# Altium project COM_DIO_MCX.PrjPCB (part 2 of 2)

## Sheet MCX_Buffer.SchDoc: DIO MCX 16
size 420 x 297 mm; Author: G.Kasprowicz; CompanyName: WUT ISE; DrawnBy: G.Kasprowicz; Organization: WUT ISE; Address1: PW ISE; Address2: Nowowiejska 15/19 00-665 Warsaw; Address3: gkasprow@gmail.com; DocumentNumber: 5; Revision: 2; SheetNumber: 5; SheetTotal: 7; ModifiedBy: -; CheckedDate: -; Title2: TTL buffers; DivGrp: WUT ISE; Designer: G.Kasprowicz; ModifiedDate: -; ProjectName: Sensor Box
Used 2 times, as channels U_DIO_MCX/U_MCX_BufferA, U_DIO_MCX/U_MCX_BufferB. Parts and nets are listed once, with the designators drawn on the sheet.
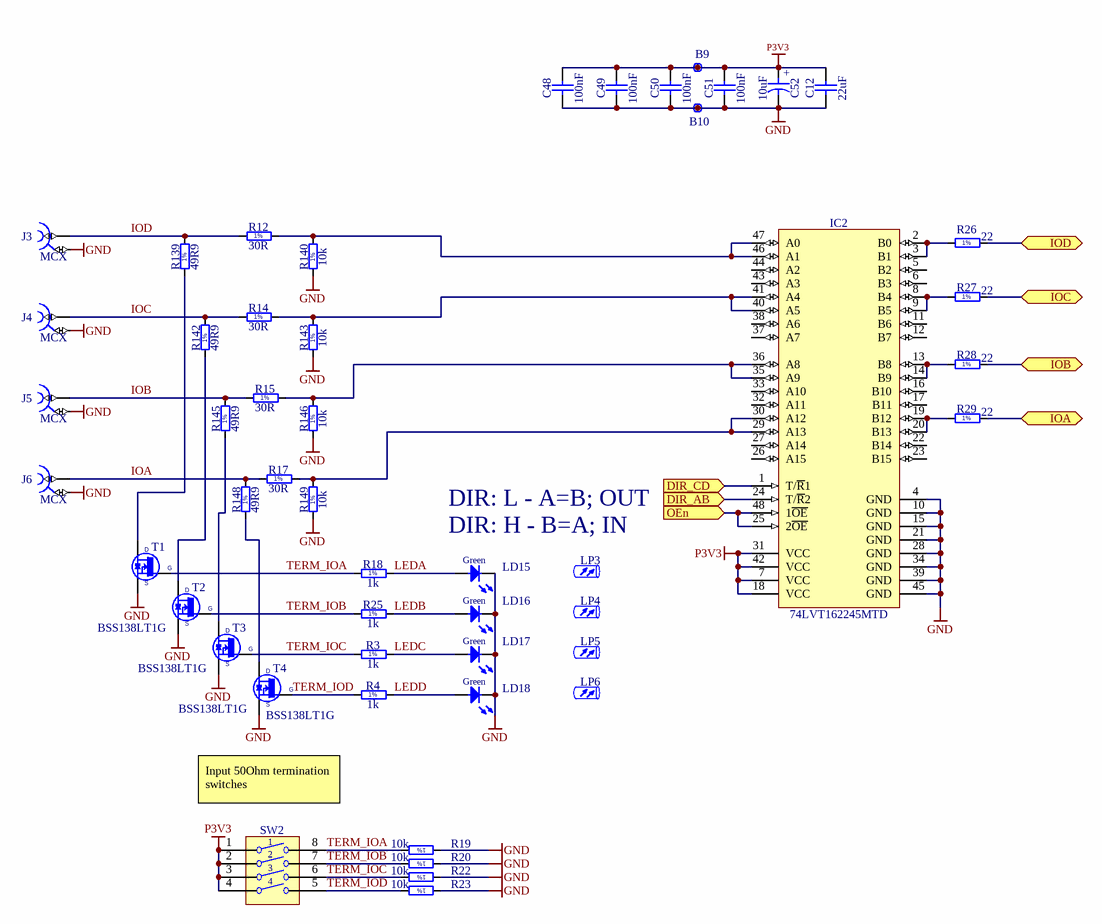
[diagram p4: MCX_Buffer.SchDoc]

### Parts
B9  Plated Hole  [c130h60]  (value not drawn)
B10  Plated Hole  [c130h60]  (value not drawn)
C12  22uF  [CAPC2012X135N]
C48  100nF  [CAPC1005X55N]
C49  100nF  [CAPC1005X55N]
C50  100nF  [CAPC1005X55N]
C51  100nF  [CAPC1005X55N]
C52  10uF  [CAPAE430X540N]
IC2  74LVT162245MTD  [SOP50P810X120-48N]
J3  MCX  [Belfuse_133-3701-801]
J4  MCX  [Belfuse_133-3701-801]
J5  MCX  [Belfuse_133-3701-801]
J6  MCX  [Belfuse_133-3701-801]
LD15  Green  [LED_AVAGO_HSME-C120]  (value not drawn)
LD16  Green  [LED_AVAGO_HSME-C120]  (value not drawn)
LD17  Green  [LED_AVAGO_HSME-C120]  (value not drawn)
LD18  Green  [LED_AVAGO_HSME-C120]  (value not drawn)
LP3  (no value)  [FIX&FASTEN-LEMB2-8V0-F]
LP4  (no value)  [FIX&FASTEN-LEMB2-8V0-F]
LP5  (no value)  [FIX&FASTEN-LEMB2-8V0-F]
LP6  (no value)  [FIX&FASTEN-LEMB2-8V0-F]
R3  1k  [RESC1005X40N]
R4  1k  [RESC1005X40N]
R12  30R  [RESC3225X70N]
R14  30R  [RESC3225X70N]
R15  30R  [RESC3225X70N]
R17  30R  [RESC3225X70N]
R18  1k  [RESC1005X40N]
R19  10k  [RESC1005X40N]
R20  10k  [RESC1005X40N]
R22  10k  [RESC1005X40N]
R23  10k  [RESC1005X40N]
R25  1k  [RESC1005X40N]
R26  22  [RESC1005X40N]
R27  22  [RESC1005X40N]
R28  22  [RESC1005X40N]
R29  22  [RESC1005X40N]
R139  49R9  [RESC3225X70N]
R140  10k  [RESC1005X40N]
R142  49R9  [RESC3225X70N]
R143  10k  [RESC1005X40N]
R145  49R9  [RESC3225X70N]
R146  10k  [RESC1005X40N]
R148  49R9  [RESC3225X70N]
R149  10k  [RESC1005X40N]
SW2  Switch  [SW_OMRON_A6S-4102-H]  (value not drawn)
T1  BSS138LT1G  [SOT95P240X110-3N]
T2  BSS138LT1G  [SOT95P240X110-3N]
T3  BSS138LT1G  [SOT95P240X110-3N]
T4  BSS138LT1G  [SOT95P240X110-3N]

### Ports
DIR_AB (in), DIR_CD (in), IOA (bidir), IOB (bidir), IOC (bidir), IOD (bidir), OEn (in)

### Nets
GND: B10.1 C12.1 C48.1 C49.1 C50.1 C51.1 C52.2 IC2.4(GND) IC2.10(GND) IC2.15(GND) IC2.21(GND) IC2.28(GND) IC2.34(GND) IC2.39(GND) IC2.45(GND) J3.2 J4.2 J5.2 J6.2 LD15.1(C) LD16.1(C) LD17.1(C) LD18.1(C) R19.1 R20.1 R22.1 R23.1 R140.1 R143.1 R146.1 R149.1 T1.2(S) T2.2(S) T3.2(S) T4.2(S)
P3V3: B9.1 C12.2 C48.2 C49.2 C50.2 C51.2 C52.1 IC2.7(VCC) IC2.18(VCC) IC2.31(VCC) IC2.42(VCC) SW2.1 SW2.2 SW2.3 SW2.4
DIR_AB: IC2.24(T/~{R}2) ; port DIR_AB
DIR_CD: IC2.1(T/~{R}1) ; port DIR_CD
IOA: J6.1 R17.1 R148.2
IOA: R29.2 ; port IOA  [a separate net that carries the same name]
IOB: J5.1 R15.1 R145.2
IOB: R28.2 ; port IOB  [a separate net that carries the same name]
IOC: J4.1 R14.1 R142.2
IOC: R27.2 ; port IOC  [a separate net that carries the same name]
IOD: J3.1 R12.1 R139.2
IOD: R26.2 ; port IOD  [a separate net that carries the same name]
LEDA: LD15.2(A) R18.2
LEDB: LD16.2(A) R25.2
LEDC: LD17.2(A) R3.2
LEDD: LD18.2(A) R4.2
OEn: IC2.25(2~{OE}) IC2.48(1~{OE}) ; port OEn
TERM_IOA: R18.1 R19.2 SW2.8 T1.1(G)
TERM_IOB: R20.2 R25.1 SW2.7 T2.1(G)
TERM_IOC: R3.1 R22.2 SW2.6 T3.1(G)
TERM_IOD: R4.1 R23.2 SW2.5 T4.1(G)
NetIC2_2: IC2.2(B0) IC2.3(B1) R26.1
NetIC2_8: IC2.8(B4) IC2.9(B5) R27.1
NetIC2_13: IC2.13(B8) IC2.14(B9) R28.1
NetIC2_19: IC2.19(B12) IC2.20(B13) R29.1
NetIC2_29: IC2.29(A13) IC2.30(A12) R17.2 R149.2
NetIC2_35: IC2.35(A9) IC2.36(A8) R15.2 R146.2
NetIC2_40: IC2.40(A5) IC2.41(A4) R14.2 R143.2
NetIC2_46: IC2.46(A1) IC2.47(A0) R12.2 R140.2
NetR139_1: R139.1 T1.3(D)
NetR142_1: R142.1 T2.3(D)
NetR145_1: R145.1 T3.3(D)
NetR148_1: R148.1 T4.3(D)

Not connected (* = marked no-connect by the designer): IC2 5(B2) 6(B3) 11(B6) 12(B7) 16(B10) 17(B11) 22(B14) 23(B15) 26(A15) 27(A14) 32(A11) 33(A10) 37(A7) 38(A6) 43(A3) 44(A2)

### Channels
U_DIO_MCX/U_MCX_BufferA: designators end in A; ports DIR_AB=NetIC2A_24 DIR_CD=NetIC2A_1 IOA=NetR29A_2 IOB=NetR28A_2 IOC=NetR27A_2 IOD=NetR26A_2 OEn=NetIC2A_25
U_DIO_MCX/U_MCX_BufferB: designators end in B; ports DIR_AB=NetIC2A_24 DIR_CD=NetIC2A_1 IOA=NetR29A_2 IOB=NetR28A_2 IOC=NetR27A_2 IOD=NetR26A_2 OEn=NetIC2A_25

### Notes on the sheet
- DIR: L - A=B; OUT
- DIR: H - B=A; IN
- Input 50Ohm termination switches
- Project/Equipment
- Document
- Designer
- Drawn by
- Check.by
- Copyright WUT ISE 2018.
  This documentation describes Open Hardware and is licensed under the CERN OHL v.1.1. You may redistribute and modify this documentation under the terms of the CERN OHL v.1.1. (http://ohwr.org/CERNOHL). This documentation is distributed WITHOUT ANY EXPRESS OR IMPLIED WARRANTY, INCLUDING OF MERCHANTABILITY, SATISFACTORY QUALITY AND FITNESS FOR A PARTICULAR PURPOSE. Please see the CERN OHL v.1.1 for applicable conditions.
- Contact
- File
- Last Mod.
- Print Date
- Sheet
- Size
- A3
- of
- Rev
- (in symbol CAE430-540_10UF_16V_20%) +
- (in symbol R0402_1K_1%_0.0625W_100PPM) 1%
- (in symbol R0402_10K_1%_0.0625W_100PPM) 1%
- (in symbol R0402_22R_1%_0.0625W_100PPM) 1%
- (in symbol R1210_30R_5%_0.5W_200PPM) 1%
- (in symbol R1210_49R9_1%_0.5W_100PPM_VISHAY_CRCW) 1%

### Library data of the parts
B9 B10 = PLATED_HOLE0.6_PAD1.3: Single Terminal Socket; Part Description: Plated Through Hole: Hole Dia.=0.6mm Pad Dia.=1.3mm; Mounted: No; Part Number: PLATED_HOLE0.6_PAD1.3; Component Kind: Standard (No BOM); Component Type: Standard (No BOM); Pin Count: 1; Family: Plated Hole; Socket: No; SMD: No; Sense: No; Status: None; ComponentHeight: 0mm; HelpURL: Undefined; Author: CERN DEM MR; CreateDate: 02.03.2016; LatestRevisionDate: 02.03.2016; PackageDescription: Plated Through Hole: Hole Dia.=0.6mm Pad Dia.=1.3mm
C12 = CC0805_22UF_16V_10%_X5R: Non-polarised capacitor; Part Description: SMD Multilayer Chip Ceramic Capacitor; Manufacturer: GENERIC; Manufacturer1 Part Number: C2012X5R1C226KT; Voltage: 16V; TC: X5R; Tolerance: ±10%; Part Number: CC0805_22UF_16V_10%_X5R; Component Kind: Standard; Component Type: Standard; Pin Count: 2; Value: 22uF; Status: Preferred; Manufacturer Part Number: CC0805_22UF_16V_10%_X5R; Case: 0805; Mounted: Yes; Socket: No; SMD: Yes; Sense: No; Manufacturer1 Example: TDK; Manufacturer1 ComponentHeight: 1.35mm; HelpURL: \\cern.ch\dfs\Applications\Altium\Datasheets\CC0805_X5R_TDK_C.pdf; Author: CERN DEM JLC; CreateDate: 25.10.2012; LatestRevisionDate: 25.10.2012
C48-C51 = CC0402_100NF_16V_10%_X5R: Non-polarised capacitor; Part Description: SMD Multilayer Chip Ceramic Capacitor; Manufacturer: GENERIC; Manufacturer1 Part Number: GRM155R61C104KA88D; Voltage: 16V; TC: X5R; Tolerance: ±10%; Part Number: CC0402_100NF_16V_10%_X5R; Component Kind: Standard; Component Type: Standard; Pin Count: 2; Value: 100nF; Status: None; Manufacturer Part Number: CC0402_100NF_16V_10%_X5R; Case: 0402; Mounted: Yes; Socket: No; SMD: Yes; Sense: No; Manufacturer1 Example: MURATA; Manufacturer1 ComponentHeight: 0.55mm; HelpURL: \\cern.ch\dfs\Applications\Altium\Datasheets\CC0402_X5R_MURATA_GRM.pdf; Author: CERN DEM JLC; CreateDate: 10.12.2013; LatestRevisionDate: 10.12.2013
C52 = CAE430-540_10UF_16V_20%: Polarised capacitor; Part Description: Aluminum Electrolytic SMT Capacitor; Manufacturer: PANASONIC; Manufacturer Part Number: EEEFK1C100AR; Voltage: 16V; Tolerance: ±20%; Part Number: CAE430-540_10UF_16V_20%; Component Kind: Standard; Component Type: Standard; Pin Count: 2; Value: 10uF; Status: Not Recommended; Case: B; Mounted: Yes; Socket: No; SMD: Yes; Sense: No; ComponentHeight: 5.8mm; HelpURL: \\cern.ch\dfs\Applications\Altium\Datasheets\CAE_PANASONIC_FK.pdf; Author: CERN DEM JLC; CreateDate: 03.12.2007; LatestRevisionDate: 05.11.2014
IC2 = 74LVT162245MTD: Low Voltage 16-Bit Transceiver with 3-STATE Outputs and 25 Ohm Series Resistors in A Port Outputs; Manufacturer: FAIRCHILD SEMICONDUCTOR; PressFit: No; Bonding: No; Part Number: 74LVT162245MTD; Component Kind: Standard; Component Type: Standard; Device: 74LVT162245MTD; PackageDescription: SOP, 48-Leads, Body 12.6x6.2mm (max), Pitch 0.50mm, IPC Medium Density; Part Description: Low Voltage 16-Bit Transceiver with 3-STATE Outputs and 25 Ohm Series Resistors in A Port Outputs; Manufacturer Part Number: 74LVT162245MTD; Pin Count: 48; Case: TSSOP48; Mounted: Yes; Socket: No; SMD: Yes; Sense: No; ComponentHeight: 1.2mm; Author: CERN DEM MR; HelpURL: \\cern.ch\dfs\Applications\Altium\Datasheets\74LVT162245MTD.pdf; CreateDate: 06.12.2016; LatestRevisionDate: 06.12.2016
J3-J6 = CON_MCX_133-3701-801: MCX 50 OhmEnd Launch Jack Receptacle -Round C ontact; Part Number: Belfuse_133-3701-806; Part Description: 50 Ohm, RF Connector, MCX Right Angle PCB Receptacle Jack; Manufacturer: Belfuse/Cinch; Manufacturer Part Number: 133-3701-806; PressFit: No; Component Kind: Standard; Component Type: Standard; Footprint: Belfuse_133-3701-806; Pin Count: 5; Family: MCX; Mounted: Yes; Socket: No; SMD: Yes; Sense: No; Status: None; ComponentHeight: 6mm; HelpURL: \\cern.ch\dfs\Applications\Altium\Datasheets\AMPHENOL_919-383J-51A.pdf; Author: GK; CreateDate: 31.01.2019; LatestRevisionDate: 31.01.2019
LD15-LD18 = LED_AVAGO_HSME-C120: LED Green 1C 2A; Part Description: High Performance Right Angle Chip Green LED; Manufacturer: AVAGO TECHNOLOGIES; PressFit: No; Bonding: No; Part Number: LED_AVAGO_HSME-C120; Component Kind: Standard; Component Type: Standard; Color: Green; PackageDescription: Green Chip LED, 2-Leads, Body 1.7x1.1mm, Side Emitting Package; Manufacturer Part Number: HSME-C120; Pin Count: 2; Mounted: Yes; Socket: No; SMD: Yes; Sense: No; ComponentHeight: 0.7mm; HelpURL: \\cern.ch\dfs\Applications\Altium\Datasheets\LED_AVAGO_HSME-C120.pdf; ComponentLink1URL: \\cern.ch\dfs\Applications\Altium\Datasheets\LED_AVAGO_HSME-C110_DESIGN-GUIDE.pdf; ComponentLink1Description: Design Guide; Author: CERN DEM JMW; CreateDate: 22.07.2009; LatestRevisionDate: 20.06.2012
LP3-LP6 = LED Light_pipe_2.3x8mm: Part Description: Right Angle Single Element 2.3x8mm Round Lightpipe; Manufacturer: FIX&FASTEN; Manufacturer Part Number: FIX-LEMB2-8V0-F; PressFit: No; Bonding: No; Part Number: FIX&FASTEN-LEMB2-8V0-F; Component Kind: Accessories; Component Type: Standard; PackageDescription: Right Angle Single Element 2.3mmx8mm Round Lightpipe; Pin Count: 0; Mounted: Yes; Socket: No; SMD: No; Sense: No; ComponentHeight: 2.3mm; HelpURL: \\cern.ch\dfs\Applications\Altium\Datasheets\LEDLP_DIALIGHT_515-1049F.pdf; Author: GK; CreateDate: 24.01.2017; LatestRevisionDate: 24.01.2017
R3 R4 R18 R25 = R0402_1K_1%_0.0625W_100PPM: Resistor - 1%; Part Description: General Purpose Thick Film Chip Resistor; Manufacturer: GENERIC; Manufacturer1 Part Number: 232270671002L; TC: ±100ppm/°C; PressFit: No; Part Number: R0402_1K_1%_0.0625W_100PPM; Component Kind: Standard; Component Type: Standard; Pin Count: 2; Value: 1k; Status: Not Recommended; Power: 0.0625W; Tolerance: ±1%; Manufacturer Part Number: R0402_1K_1%_0.0625W_100PPM; Case: 0402; Mounted: Yes; Sense: No; Socket: No; SMD: Yes; Manufacturer1 Example: YAGEO PHYCOMP; Manufacturer1 ComponentHeight: 0.4mm; HelpURL: \\cern.ch\dfs\Applications\Altium\Datasheets\R0402_Phycomp_RC0402.pdf; Author: CERN DEM JLC; CreateDate: 03.12.2007; LatestRevisionDate: 17.10.2012
R12 R14 R15 R17 = R1210_30R_5%_0.5W_200PPM: Resistor - 5%; Part Description: Thick Film Chip Resistor; Manufacturer: VISHAY; Manufacturer Part Number: CRCW121030R0JNEA; Power: 0.5W; TC: ±200ppm/°C; PressFit: No; Part Number: R1210_30R_5%_0.5W_200ppm; Component Kind: Standard; Component Type: Standard; Pin Count: 2; Value: 30R; Status: None; Tolerance: ±5%; Case: 1210; Mounted: Yes; Sense: No; Socket: No; SMD: Yes; HelpURL: \\cern.ch\dfs\Applications\Altium\Datasheets\R1210_VISHAY_CRCW1210.pdf; Author: CERN DEM JMW; CreateDate: 06.08.2014; LatestRevisionDate: 06.08.2014; ComponentHeight: 0.6mm
R19 R20 R22 R23 R140 R143 R146 R149 = R0402_10K_1%_0.0625W_100PPM: Resistor - 1%; Part Description: General Purpose Thick Film Chip Resistor; Manufacturer: GENERIC; Manufacturer1 Part Number: 232270671003L; TC: ±100ppm/°C; Part Number: R0402_10K_1%_0.0625W_100PPM; Component Kind: Standard; Component Type: Standard; Pin Count: 2; Value: 10k; Status: Not recommended; Power: 0.0625W; Tolerance: ±1%; Manufacturer Part Number: R0402_10K_1%_0.0625W_100PPM; Case: 0402; Mounted: Yes; Sense: No; Socket: No; SMD: Yes; Manufacturer1 Example: YAGEO PHYCOMP; Manufacturer1 ComponentHeight: 0.4mm; HelpURL: \\cern.ch\dfs\Applications\Altium\Datasheets\R0402_Phycomp_RC0402.pdf; Author: CERN DEM JLC; CreateDate: 03.12.2007; LatestRevisionDate: 17.10.2012
R26-R29 = R0402_22R_1%_0.0625W_100PPM: Resistor - 1%; Part Description: General Purpose Thick Film Chip Resistor; Manufacturer: GENERIC; Manufacturer1 Part Number: 232270672209L; TC: ±100ppm/°C; PressFit: No; Part Number: R0402_22R_1%_0.0625W_100PPM; Component Kind: Standard; Component Type: Standard; Pin Count: 2; Value: 22; Status: Not Recommended; Power: 0.0625W; Tolerance: ±1%; Manufacturer Part Number: R0402_22R_1%_0.0625W_100PPM; Case: 0402; Mounted: Yes; Sense: No; Socket: No; SMD: Yes; Manufacturer1 Example: YAGEO PHYCOMP; Manufacturer1 ComponentHeight: 0.4mm; HelpURL: \\cern.ch\dfs\Applications\Altium\Datasheets\R0402_Phycomp_RC0402.pdf; Author: CERN DEM JLC; CreateDate: 03.12.2007; LatestRevisionDate: 17.10.2012
R139 R142 R145 R148 = R1210_49R9_1%_0.5W_100PPM_VISHAY_CRCW: Resistor - 1%; Part Description: Thick Film Chip Resistor; Manufacturer: VISHAY DRALORIC; Manufacturer Part Number: CRCW121049R9FKTA; Power: 0.5W; TC: ±100ppm/°C; Part Number: R1210_49R9_1%_0.5W_100PPM_VISHAY_CRCW; Component Kind: Standard; Component Type: Standard; Pin Count: 2; Value: 49R9; Status: None; Tolerance: ±1%; Case: 1210; Mounted: Yes; Sense: No; Socket: No; SMD: Yes; ComponentHeight: 0.6mm; HelpURL: \\cern.ch\dfs\Applications\Altium\Datasheets\R1210_VISHAY_CRCW1210.pdf; Author: CERN DEM JMW; CreateDate: 06.08.2014; LatestRevisionDate: 06.08.2014
SW2 = SW_OMRON_A6S-4102-H: 4 Ways SPST DIP Switch; Part Description: 4 Ways SPST DIP Switch, White Flat Actuator with Seal Tape, Contact Rating 25mA 24VDC; Manufacturer: OMRON; PressFit: No; Part Number: SW_OMRON_A6S-4102-H; Component Kind: Standard; Component Type: Standard; Pin Count: 8; PackageDescription: Pitch 2.54mm, Body 11.3x6.4mm, 4 Ways SPST Surface-Mounting DIP Switch, OMRON A6S-H; Family: Switch; Mounted: Yes; Socket: No; SMD: Yes; Sense: No; Status: None; Manufacturer Part Number: A6S-4102-H; ComponentHeight: 3.8mm; HelpURL: \\cern.ch\dfs\Applications\Altium\Datasheets\SW_OMRON_A6S-4102-H.pdf; Author: CERN DEM JMW; CreateDate: 25.09.2008; LatestRevisionDate: 25.09.2008
T1-T4 = BSS138LT1G: N-CHANNEL MOSFET WITH DIODE; Part Description: 50V 200mA N-Channel Enhancement Mode Field-Effect Transistor; Manufacturer: ON SEMICONDUCTOR; PressFit: No; Bonding: No; Part Number: BSS138LT1G; Component Kind: Standard; Component Type: Standard; Device: BSS138LT1G; PackageDescription: SOT23 3-Leads, Pitch 0.95mm - Body 1.4x3mm, IPC Medium Density; Manufacturer Part Number: BSS138LT1G; Pin Count: 3; Case: SOT23-3; Mounted: Yes; Socket: No; SMD: Yes; Sense: No; ComponentHeight: 1.11mm; HelpURL: \\cern.ch\dfs\Applications\Altium\Datasheets\BSS138LT1G.pdf; Author: CERN DEM JLC; CreateDate: 23.03.2009; LatestRevisionDate: 23.03.2009

## Sheet MCX_Mezzanine.SchDoc: DIO MCX 16
size 420 x 297 mm; Author: G.Kasprowicz; CompanyName: WUT ISE; DrawnBy: G.Kasprowicz; Organization: WUT ISE; Address1: PW ISE; Address2: Nowowiejska 15/19 00-665 Warsaw; Address3: gkasprow@gmail.com; DocumentNumber: 6; Revision: 2; SheetNumber: 6; SheetTotal: 7; ModifiedBy: -; CheckedDate: -; Title2: Mezzanine; DivGrp: WUT ISE; Designer: G.Kasprowicz; ModifiedDate: -; ProjectName: Sensor Box
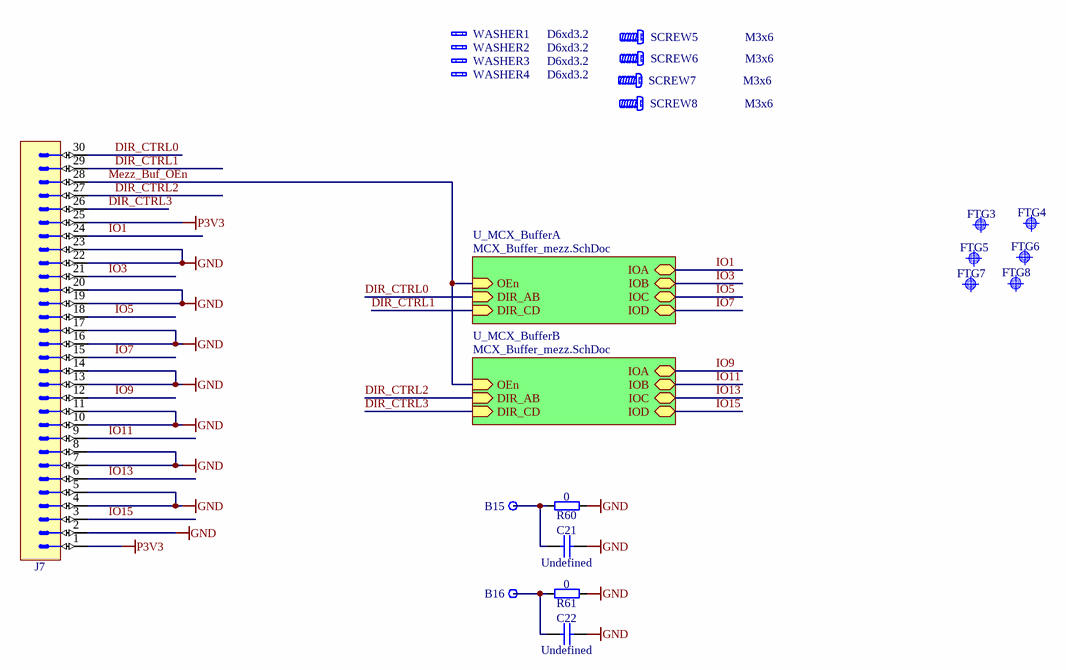
[diagram p5: MCX_Mezzanine.SchDoc]

### Parts
B15  Plated Hole  [MTG270_500]  (value not drawn)
B16  Plated Hole  [MTG270_500]  (value not drawn)
C21  Undefined  [CAPC2012X135N]
C22  Undefined  [CAPC2012X135N]
FTG3  Use only in PCB  [FIDUCIAL_TOP_S100-200]  (value not drawn)
FTG4  Use only in PCB  [FIDUCIAL_TOP_C100-200]  (value not drawn)
FTG5  Use only in PCB  [FIDUCIAL_TOP_S100-200]  (value not drawn)
FTG6  Use only in PCB  [FIDUCIAL_TOP_C100-200]  (value not drawn)
FTG7  Use only in PCB  [FIDUCIAL_TOP_C100-200]  (value not drawn)
FTG8  Use only in PCB  [FIDUCIAL_TOP_S100-200]  (value not drawn)
J7  AMPMODU  [TYCO_1-215307-5]  (value not drawn)
R60  0  [RESC1608X55N]
R61  0  [RESC1608X55N]
SCREW5  M3x6  [BOSSARD_BN5687-3061605_v]
SCREW6  M3x6  [BOSSARD_BN5687-3061605_v]
SCREW7  M3x6  [BOSSARD_BN5687-3061605_v]
SCREW8  M3x6  [BOSSARD_BN5687-3061605_v]
WASHER1  D6xd3.2  [BOSSARD_B3/6/0.3/BN1976_v]
WASHER2  D6xd3.2  [BOSSARD_B3/6/0.3/BN1976_v]
WASHER3  D6xd3.2  [BOSSARD_B3/6/0.3/BN1976_v]
WASHER4  D6xd3.2  [BOSSARD_B3/6/0.3/BN1976_v]

### Sub-sheets
U_MCX_BufferA = MCX_Buffer_mezz.SchDoc: IOA (bidir), IOB (bidir), IOC (bidir), IOD (bidir), DIR_AB (in), OEn (in), DIR_CD (in)
U_MCX_BufferB = MCX_Buffer_mezz.SchDoc: OEn (in), DIR_AB (in), DIR_CD (in), IOA (bidir), IOB (bidir), IOC (bidir), IOD (bidir)

### Nets
GND: C21.2 C22.2 J7.2 J7.4 J7.5 J7.7 J7.8 J7.10 J7.11 J7.13 J7.14 J7.16 J7.17 J7.19 J7.20 J7.22 J7.23 R60.1 R61.1
P3V3: J7.1 J7.25
DIR_CTRL0: J7.30 ; sheet U_MCX_BufferA/DIR_AB
DIR_CTRL1: J7.29 ; sheet U_MCX_BufferA/DIR_CD
DIR_CTRL2: J7.27 ; sheet U_MCX_BufferB/DIR_AB
DIR_CTRL3: J7.26 ; sheet U_MCX_BufferB/DIR_CD
IO1: J7.24 ; sheet U_MCX_BufferA/IOA
IO3: J7.21 ; sheet U_MCX_BufferA/IOB
IO5: J7.18 ; sheet U_MCX_BufferA/IOC
IO7: J7.15 ; sheet U_MCX_BufferA/IOD
IO9: J7.12 ; sheet U_MCX_BufferB/IOA
IO11: J7.9 ; sheet U_MCX_BufferB/IOB
IO13: J7.6 ; sheet U_MCX_BufferB/IOC
IO15: J7.3 ; sheet U_MCX_BufferB/IOD
Mezz_Buf_OEn: J7.28 ; sheet U_MCX_BufferA/OEn, sheet U_MCX_BufferB/OEn
NetB15_1: B15.1 C21.1 R60.2
NetB16_1: B16.1 C22.1 R61.2

### Notes on the sheet
- Project/Equipment
- Document
- Designer
- Drawn by
- Check.by
- Copyright WUT ISE 2018.
  This documentation describes Open Hardware and is licensed under the CERN OHL v.1.1. You may redistribute and modify this documentation under the terms of the CERN OHL v.1.1. (http://ohwr.org/CERNOHL). This documentation is distributed WITHOUT ANY EXPRESS OR IMPLIED WARRANTY, INCLUDING OF MERCHANTABILITY, SATISFACTORY QUALITY AND FITNESS FOR A PARTICULAR PURPOSE. Please see the CERN OHL v.1.1 for applicable conditions.
- Contact
- File
- Last Mod.
- Print Date
- Sheet
- Size
- A3
- of
- Rev

### Library data of the parts
B15 B16 = PLATED_HOLE2.7_PAD5.0: Single Terminal Socket; Part Description: Plated Through Hole: Hole Dia.=2.7mm Pad Dia.=5.0mm; Mounted: No; Part Number: PLATED_HOLE2.7_PAD5.0; Component Kind: Standard (No BOM); Component Type: Standard (No BOM); Pin Count: 1; Family: Plated Hole; Socket: No; SMD: No; Sense: No; Status: None; ComponentHeight: 0mm; HelpURL: Undefined; Author: CERN DEM JMW; CreateDate: 27.09.2011; LatestRevisionDate: 27.09.2011; PackageDescription: Plated Through Hole: Hole Dia.=2.7mm Pad Dia.=5.0mm
C21 C22 = CC0805_NO-VALUE: Non-polarised capacitor; Part Description: Reserved Footprint For 0805(2012) Chip Ceramic Capacitor; Mounted: No; Part Number: CC0805_NO-VALUE; Component Kind: Standard; Component Type: Standard; Pin Count: 2; Value: Undefined; Status: None; Manufacturer: Undefined; Manufacturer Part Number: CC0805_NO-VALUE; Case: 0805; Socket: No; SMD: Yes; Sense: No; Manufacturer1 ComponentHeight: 1.35mm; HelpURL: Undefined; Author: CERN DEM JLC; CreateDate: 10.12.2008; LatestRevisionDate: 11.09.2013
FTG3 FTG5 FTG8 = FIDUCIAL_TARGET_S100-200: Fiducial Target; Part Description: Square Fiducial Target, Top Layer, 1.0mm, Top Solder 2.0mm, Keepout =2.0mm; Mounted: No; Part Number: FIDUCIAL_TARGET_S100-200; Component Kind: Standard (No BOM); Component Type: Standard (No BOM); Pin Count: 1; Family: Fiducial; Socket: No; SMD: Yes; Sense: No; Status: None; ComponentHeight: 0mm; HelpURL: Undefined; Author: CERN DEM JLC; CreateDate: 09.02.2010; LatestRevisionDate: 04.04.2012; PackageDescription: Square Fiducial Target, Top Layer, 1.0mm, Top Solder 2.0mm, Keepout =2.0mm
FTG4 FTG6 FTG7 = FIDUCIAL_TARGET_C100-200: Fiducial Target; Part Description: Round Fiducial Target, Top Layer, 1.0mm, Top Solder 2.0mm, Keepout =2.0mm; Mounted: No; Part Number: FIDUCIAL_TARGET_C100-200; Component Kind: Standard (No BOM); Component Type: Standard (No BOM); Pin Count: 1; Family: Fiducial; Socket: No; SMD: Yes; Sense: No; Status: None; ComponentHeight: 0mm; HelpURL: Undefined; Author: CERN DEM JLC; CreateDate: 09.02.2010; LatestRevisionDate: 04.04.2012; PackageDescription: Round Fiducial Target, Top Layer, 1.0mm, Top Solder 2.0mm, Keepout =2.0mm
J7 = CON_2x15_2.54_female_V_mirror: Connector 2.54mm, 30 pin female, vertical, 7mm, AMPMODU HV-100/HV-190; Part Description: 34 Contacts, Dual Row Vertical Low Profile IDC Shrouded Header, with Long Eject Latch; Manufacturer: TYCO ELECTRONICS; Manufacturer Part Number: 1-215307-5; PressFit: No; Part Number: TYCO_1-215307-5; Component Kind: Standard; Component Type: Standard; Pin Count: 30; Family: AMPMODU; Mounted: Yes; Socket: No; SMD: No; Sense: No; Status: None; ComponentHeight: 22.86mm; HelpURL: \\cern.ch\dfs\Applications\Altium\Datasheets\TYCO_3-1761606-1.pdf; Author: GK; CreateDate: 05.10.2015; LatestRevisionDate: 05.10.2015
R60 R61 = R0603_0R_JUMPER: Resistor; Part Description: 1A (0.05R Max DC Resistance) Zero Ohm Jumper; Manufacturer: GENERIC; Manufacturer1 Part Number: NRC06Z0; PressFit: No; Part Number: R0603_0R_JUMPER; Component Kind: Standard; Component Type: Standard; Pin Count: 2; Value: 0; Status: Preferred; Manufacturer Part Number: R0603_0R_JUMPER; Case: 0603; Mounted: Yes; Sense: No; Socket: No; SMD: Yes; Manufacturer1 Example: NIC COMPONENT; Manufacturer1 ComponentHeight: 0.55mm; HelpURL: \\cern.ch\dfs\Applications\Altium\Datasheets\R0603_NIC_NRC.pdf; Author: CERN DEM JLC; CreateDate: 03.12.2007; LatestRevisionDate: 13.03.2008
SCREW5-SCREW8 = BOSSARD_BN5687-3061605_v: Screw; Part Description: M3 L=6mm Hexalobular Socket Pan Head Screw, Fully Threaded, Stainless Steel A2; Manufacturer Part Number: BN5687 Art.3061605; PressFit: No; Part Number: BOSSARD_BN5687-3061605_v; Component Kind: Standard; Component Type: Mechanical; Pin Count: 0; PackageDescription: M3 L=6mm Hexalobular Socket Pan Head Screw, Fully Threaded - Stainless Steel A2; Mounted: Yes; Socket: No; SMD: No; Sense: No; Status: None; Value: M3x6; Manufacturer: BOSSARD; ComponentHeight: 2.4mm; HelpURL: \\cern.ch\dfs\Applications\Altium\Datasheets\BOSSARD_BN5687-3061605.pdf; Author: CERN DEM JLC; CreateDate: 15.01.2013; LatestRevisionDate: 15.01.2013
WASHER1-WASHER4 = MECH_Washer_M3x0.3x6: Washer, M3x0.3x6; Part Number: BOSSARD_B3/6/0.3/BN1976; Part Description: Flat Washer without Chamfer for M3 Screw, Steel; Manufacturer: BOSSARD; Manufacturer Part Number: B3/6/0.3/BN1976; PressFit: No; Component Kind: Standard; Component Type: Mechanical; Pin Count: 0; PackageDescription: Flat Washer without Chamfer for M3 Screw, steel; Mounted: Yes; Socket: No; SMD: No; Sense: No; Status: None; Value: D6xd3.2; ComponentHeight: 0.5mm; HelpURL: \\cern.ch\dfs\Applications\Altium\Datasheets\BOSSARD_BN1074-1404830.pdf; Author: GK; CreateDate: 08.03.2018; LatestRevisionDate: 08.03.2018

## Sheet MCX_Buffer_mezz.SchDoc: DIO MCX 16
size 420 x 297 mm; Author: G.Kasprowicz; CompanyName: WUT ISE; DrawnBy: G.Kasprowicz; Organization: WUT ISE; Address1: PW ISE; Address2: Nowowiejska 15/19 00-665 Warsaw; Address3: gkasprow@gmail.com; DocumentNumber: 7; Revision: 2; SheetNumber: 7; SheetTotal: 7; ModifiedBy: -; CheckedDate: -; Title2: TTL buffers; DivGrp: WUT ISE; Designer: G.Kasprowicz; ModifiedDate: -; ProjectName: Sensor Box
Used 2 times, as channels U_MCX_Mezzanine/U_MCX_BufferA, U_MCX_Mezzanine/U_MCX_BufferB. Parts and nets are listed once, with the designators drawn on the sheet.
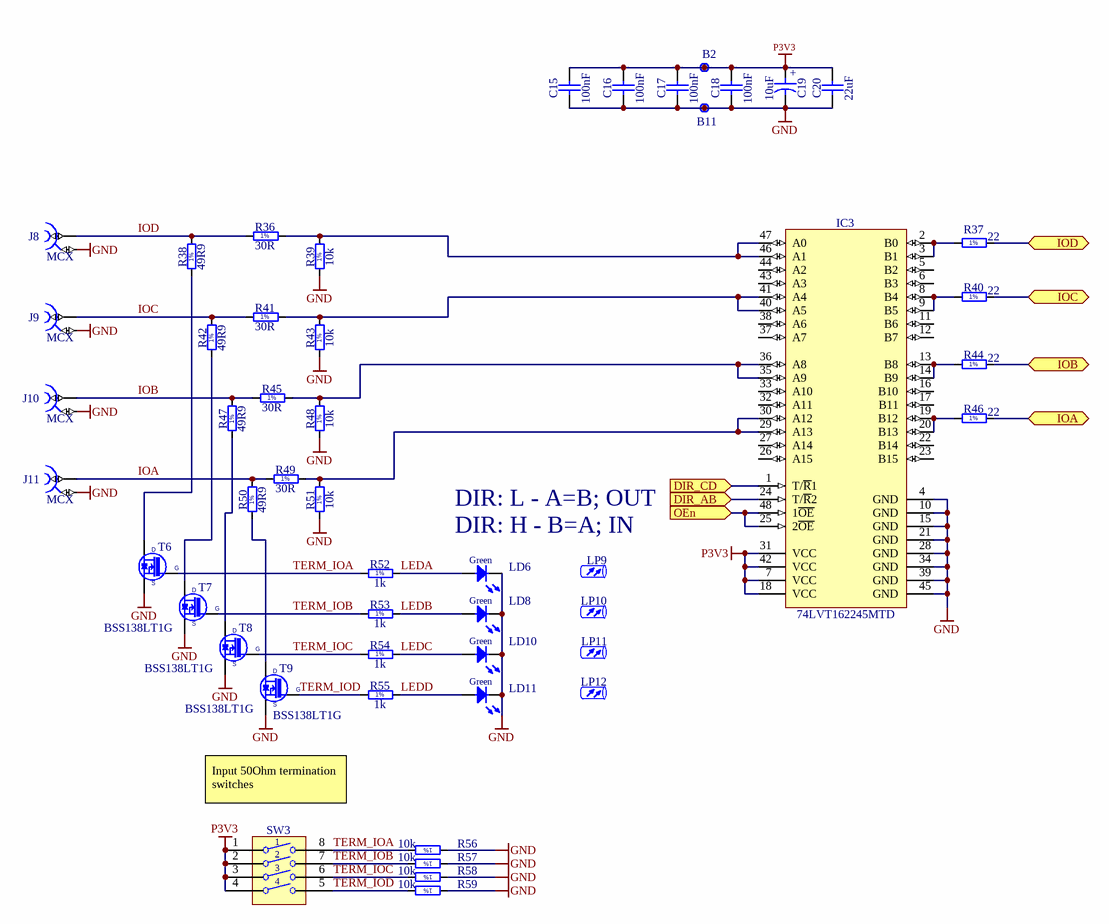
[diagram p6: MCX_Buffer_mezz.SchDoc]

### Parts
B2  Plated Hole  [c130h60]  (value not drawn)
B11  Plated Hole  [c130h60]  (value not drawn)
C15  100nF  [CAPC1005X55N]
C16  100nF  [CAPC1005X55N]
C17  100nF  [CAPC1005X55N]
C18  100nF  [CAPC1005X55N]
C19  10uF  [CAPAE430X540N]
C20  22uF  [CAPC2012X135N]
IC3  74LVT162245MTD  [SOP50P810X120-48N]
J8  MCX  [Belfuse_133-3701-801]
J9  MCX  [Belfuse_133-3701-801]
J10  MCX  [Belfuse_133-3701-801]
J11  MCX  [Belfuse_133-3701-801]
LD6  Green  [LED_AVAGO_HSME-C120]  (value not drawn)
LD8  Green  [LED_AVAGO_HSME-C120]  (value not drawn)
LD10  Green  [LED_AVAGO_HSME-C120]  (value not drawn)
LD11  Green  [LED_AVAGO_HSME-C120]  (value not drawn)
LP9  (no value)  [FIX&FASTEN-LEMB2-8V0-F]
LP10  (no value)  [FIX&FASTEN-LEMB2-8V0-F]
LP11  (no value)  [FIX&FASTEN-LEMB2-8V0-F]
LP12  (no value)  [FIX&FASTEN-LEMB2-8V0-F]
R36  30R  [RESC3225X70N]
R37  22  [RESC1005X40N]
R38  49R9  [RESC3225X70N]
R39  10k  [RESC1005X40N]
R40  22  [RESC1005X40N]
R41  30R  [RESC3225X70N]
R42  49R9  [RESC3225X70N]
R43  10k  [RESC1005X40N]
R44  22  [RESC1005X40N]
R45  30R  [RESC3225X70N]
R46  22  [RESC1005X40N]
R47  49R9  [RESC3225X70N]
R48  10k  [RESC1005X40N]
R49  30R  [RESC3225X70N]
R50  49R9  [RESC3225X70N]
R51  10k  [RESC1005X40N]
R52  1k  [RESC1005X40N]
R53  1k  [RESC1005X40N]
R54  1k  [RESC1005X40N]
R55  1k  [RESC1005X40N]
R56  10k  [RESC1005X40N]
R57  10k  [RESC1005X40N]
R58  10k  [RESC1005X40N]
R59  10k  [RESC1005X40N]
SW3  Switch  [SW_OMRON_A6S-4102-H]  (value not drawn)
T6  BSS138LT1G  [SOT95P240X110-3N]
T7  BSS138LT1G  [SOT95P240X110-3N]
T8  BSS138LT1G  [SOT95P240X110-3N]
T9  BSS138LT1G  [SOT95P240X110-3N]

### Ports
DIR_AB (in), DIR_CD (in), IOA (bidir), IOB (bidir), IOC (bidir), IOD (bidir), OEn (in)

### Nets
GND: B11.1 C15.1 C16.1 C17.1 C18.1 C19.2 C20.1 IC3.4(GND) IC3.10(GND) IC3.15(GND) IC3.21(GND) IC3.28(GND) IC3.34(GND) IC3.39(GND) IC3.45(GND) J8.2 J9.2 J10.2 J11.2 LD6.1(C) LD8.1(C) LD10.1(C) LD11.1(C) R39.1 R43.1 R48.1 R51.1 R56.1 R57.1 R58.1 R59.1 T6.2(S) T7.2(S) T8.2(S) T9.2(S)
P3V3: B2.1 C15.2 C16.2 C17.2 C18.2 C19.1 C20.2 IC3.7(VCC) IC3.18(VCC) IC3.31(VCC) IC3.42(VCC) SW3.1 SW3.2 SW3.3 SW3.4
DIR_AB: IC3.24(T/~{R}2) ; port DIR_AB
DIR_CD: IC3.1(T/~{R}1) ; port DIR_CD
IOA: J11.1 R49.1 R50.2
IOA: R46.2 ; port IOA  [a separate net that carries the same name]
IOB: J10.1 R45.1 R47.2
IOB: R44.2 ; port IOB  [a separate net that carries the same name]
IOC: J9.1 R41.1 R42.2
IOC: R40.2 ; port IOC  [a separate net that carries the same name]
IOD: J8.1 R36.1 R38.2
IOD: R37.2 ; port IOD  [a separate net that carries the same name]
LEDA: LD6.2(A) R52.2
LEDB: LD8.2(A) R53.2
LEDC: LD10.2(A) R54.2
LEDD: LD11.2(A) R55.2
OEn: IC3.25(2~{OE}) IC3.48(1~{OE}) ; port OEn
TERM_IOA: R52.1 R56.2 SW3.8 T6.1(G)
TERM_IOB: R53.1 R57.2 SW3.7 T7.1(G)
TERM_IOC: R54.1 R58.2 SW3.6 T8.1(G)
TERM_IOD: R55.1 R59.2 SW3.5 T9.1(G)
NetIC3_2: IC3.2(B0) IC3.3(B1) R37.1
NetIC3_8: IC3.8(B4) IC3.9(B5) R40.1
NetIC3_13: IC3.13(B8) IC3.14(B9) R44.1
NetIC3_19: IC3.19(B12) IC3.20(B13) R46.1
NetIC3_29: IC3.29(A13) IC3.30(A12) R49.2 R51.2
NetIC3_35: IC3.35(A9) IC3.36(A8) R45.2 R48.2
NetIC3_40: IC3.40(A5) IC3.41(A4) R41.2 R43.2
NetIC3_46: IC3.46(A1) IC3.47(A0) R36.2 R39.2
NetR38_1: R38.1 T6.3(D)
NetR42_1: R42.1 T7.3(D)
NetR47_1: R47.1 T8.3(D)
NetR50_1: R50.1 T9.3(D)

Not connected (* = marked no-connect by the designer): IC3 5(B2) 6(B3) 11(B6) 12(B7) 16(B10) 17(B11) 22(B14) 23(B15) 26(A15) 27(A14) 32(A11) 33(A10) 37(A7) 38(A6) 43(A3) 44(A2)

### Channels
U_MCX_Mezzanine/U_MCX_BufferA: designators end in A; ports DIR_AB=NetIC2A_24 DIR_CD=NetIC2A_1 IOA=NetR29A_2 IOB=NetR28A_2 IOC=NetR27A_2 IOD=NetR26A_2 OEn=NetIC2A_25
U_MCX_Mezzanine/U_MCX_BufferB: designators end in B; ports DIR_AB=NetIC2A_24 DIR_CD=NetIC2A_1 IOA=NetR29A_2 IOB=NetR28A_2 IOC=NetR27A_2 IOD=NetR26A_2 OEn=NetIC2A_25

### Notes on the sheet
- DIR: L - A=B; OUT
- DIR: H - B=A; IN
- Input 50Ohm termination switches
- Project/Equipment
- Document
- Designer
- Drawn by
- Check.by
- Copyright WUT ISE 2018.
  This documentation describes Open Hardware and is licensed under the CERN OHL v.1.1. You may redistribute and modify this documentation under the terms of the CERN OHL v.1.1. (http://ohwr.org/CERNOHL). This documentation is distributed WITHOUT ANY EXPRESS OR IMPLIED WARRANTY, INCLUDING OF MERCHANTABILITY, SATISFACTORY QUALITY AND FITNESS FOR A PARTICULAR PURPOSE. Please see the CERN OHL v.1.1 for applicable conditions.
- Contact
- File
- Last Mod.
- Print Date
- Sheet
- Size
- A3
- of
- Rev
- (in symbol CAE430-540_10UF_16V_20%) +
- (in symbol R0402_1K_1%_0.0625W_100PPM) 1%
- (in symbol R0402_10K_1%_0.0625W_100PPM) 1%
- (in symbol R0402_22R_1%_0.0625W_100PPM) 1%
- (in symbol R1210_30R_5%_0.5W_200PPM) 1%
- (in symbol R1210_49R9_1%_0.5W_100PPM_VISHAY_CRCW) 1%

### Library data of the parts
B2 B11 = PLATED_HOLE0.6_PAD1.3: as B9 on sheet MCX_Buffer; Part Number: PLATED_HOLE0.6_PAD1.3; Component Kind: Standard (No BOM); Component Type: Standard (No BOM); Pin Count: 1; Family: Plated Hole; Socket: No; SMD: No; Sense: No; Status: None; ComponentHeight: 0mm; HelpURL: Undefined; Author: CERN DEM MR; CreateDate: 02.03.2016; LatestRevisionDate: 02.03.2016; PackageDescription: Plated Through Hole: Hole Dia.=0.6mm Pad Dia.=1.3mm
C15-C18 = CC0402_100NF_16V_10%_X5R: as C48 on sheet MCX_Buffer; Part Number: CC0402_100NF_16V_10%_X5R; Component Kind: Standard; Component Type: Standard; Pin Count: 2; Value: 100nF; Status: None; Manufacturer Part Number: CC0402_100NF_16V_10%_X5R; Case: 0402; Mounted: Yes; Socket: No; SMD: Yes; Sense: No; Manufacturer1 Example: MURATA; Manufacturer1 ComponentHeight: 0.55mm; HelpURL: \\cern.ch\dfs\Applications\Altium\Datasheets\CC0402_X5R_MURATA_GRM.pdf; Author: CERN DEM JLC; CreateDate: 10.12.2013; LatestRevisionDate: 10.12.2013
C19 = CAE430-540_10UF_16V_20%: as C52 on sheet MCX_Buffer; Part Number: CAE430-540_10UF_16V_20%; Component Kind: Standard; Component Type: Standard; Pin Count: 2; Value: 10uF; Status: Not Recommended; Case: B; Mounted: Yes; Socket: No; SMD: Yes; Sense: No; ComponentHeight: 5.8mm; HelpURL: \\cern.ch\dfs\Applications\Altium\Datasheets\CAE_PANASONIC_FK.pdf; Author: CERN DEM JLC; CreateDate: 03.12.2007; LatestRevisionDate: 05.11.2014
C20 = CC0805_22UF_16V_10%_X5R: as C12 on sheet MCX_Buffer; Part Number: CC0805_22UF_16V_10%_X5R; Component Kind: Standard; Component Type: Standard; Pin Count: 2; Value: 22uF; Status: Preferred; Manufacturer Part Number: CC0805_22UF_16V_10%_X5R; Case: 0805; Mounted: Yes; Socket: No; SMD: Yes; Sense: No; Manufacturer1 Example: TDK; Manufacturer1 ComponentHeight: 1.35mm; HelpURL: \\cern.ch\dfs\Applications\Altium\Datasheets\CC0805_X5R_TDK_C.pdf; Author: CERN DEM JLC; CreateDate: 25.10.2012; LatestRevisionDate: 25.10.2012
IC3 = 74LVT162245MTD: as IC2 on sheet MCX_Buffer; Part Number: 74LVT162245MTD; Component Kind: Standard; Component Type: Standard; Device: 74LVT162245MTD; PackageDescription: SOP, 48-Leads, Body 12.6x6.2mm (max), Pitch 0.50mm, IPC Medium Density; Part Description: Low Voltage 16-Bit Transceiver with 3-STATE Outputs and 25 Ohm Series Resistors in A Port Outputs; Manufacturer Part Number: 74LVT162245MTD; Pin Count: 48; Case: TSSOP48; Mounted: Yes; Socket: No; SMD: Yes; Sense: No; ComponentHeight: 1.2mm; Author: CERN DEM MR; HelpURL: \\cern.ch\dfs\Applications\Altium\Datasheets\74LVT162245MTD.pdf; CreateDate: 06.12.2016; LatestRevisionDate: 06.12.2016
J8-J11 = CON_MCX_133-3701-801: as J3 on sheet MCX_Buffer; Component Kind: Standard; Component Type: Standard; Footprint: Belfuse_133-3701-806; Pin Count: 5; Family: MCX; Mounted: Yes; Socket: No; SMD: Yes; Sense: No; Status: None; ComponentHeight: 6mm; HelpURL: \\cern.ch\dfs\Applications\Altium\Datasheets\AMPHENOL_919-383J-51A.pdf; Author: GK; CreateDate: 31.01.2019; LatestRevisionDate: 31.01.2019
LD6 LD8 LD10 LD11 = LED_AVAGO_HSME-C120: as LD15 on sheet MCX_Buffer; Part Number: LED_AVAGO_HSME-C120; Component Kind: Standard; Component Type: Standard; Color: Green; PackageDescription: Green Chip LED, 2-Leads, Body 1.7x1.1mm, Side Emitting Package; Manufacturer Part Number: HSME-C120; Pin Count: 2; Mounted: Yes; Socket: No; SMD: Yes; Sense: No; ComponentHeight: 0.7mm; HelpURL: \\cern.ch\dfs\Applications\Altium\Datasheets\LED_AVAGO_HSME-C120.pdf; ComponentLink1URL: \\cern.ch\dfs\Applications\Altium\Datasheets\LED_AVAGO_HSME-C110_DESIGN-GUIDE.pdf; ComponentLink1Description: Design Guide; Author: CERN DEM JMW; CreateDate: 22.07.2009; LatestRevisionDate: 20.06.2012
LP9-LP12 = LED Light_pipe_2.3x8mm: as LP3 on sheet MCX_Buffer; Part Number: FIX&FASTEN-LEMB2-8V0-F; Component Kind: Accessories; Component Type: Standard; PackageDescription: Right Angle Single Element 2.3mmx8mm Round Lightpipe; Pin Count: 0; Mounted: Yes; Socket: No; SMD: No; Sense: No; ComponentHeight: 2.3mm; HelpURL: \\cern.ch\dfs\Applications\Altium\Datasheets\LEDLP_DIALIGHT_515-1049F.pdf; Author: GK; CreateDate: 24.01.2017; LatestRevisionDate: 24.01.2017
R36 R41 R45 R49 = R1210_30R_5%_0.5W_200PPM: as R12 on sheet MCX_Buffer; Part Number: R1210_30R_5%_0.5W_200ppm; Component Kind: Standard; Component Type: Standard; Pin Count: 2; Value: 30R; Status: None; Tolerance: ±5%; Case: 1210; Mounted: Yes; Sense: No; Socket: No; SMD: Yes; HelpURL: \\cern.ch\dfs\Applications\Altium\Datasheets\R1210_VISHAY_CRCW1210.pdf; Author: CERN DEM JMW; CreateDate: 06.08.2014; LatestRevisionDate: 06.08.2014; ComponentHeight: 0.6mm
R37 R40 R44 R46 = R0402_22R_1%_0.0625W_100PPM: as R26 on sheet MCX_Buffer; Part Number: R0402_22R_1%_0.0625W_100PPM; Component Kind: Standard; Component Type: Standard; Pin Count: 2; Value: 22; Status: Not Recommended; Power: 0.0625W; Tolerance: ±1%; Manufacturer Part Number: R0402_22R_1%_0.0625W_100PPM; Case: 0402; Mounted: Yes; Sense: No; Socket: No; SMD: Yes; Manufacturer1 Example: YAGEO PHYCOMP; Manufacturer1 ComponentHeight: 0.4mm; HelpURL: \\cern.ch\dfs\Applications\Altium\Datasheets\R0402_Phycomp_RC0402.pdf; Author: CERN DEM JLC; CreateDate: 03.12.2007; LatestRevisionDate: 17.10.2012
R38 R42 R47 R50 = R1210_49R9_1%_0.5W_100PPM_VISHAY_CRCW: as R139 on sheet MCX_Buffer; Part Number: R1210_49R9_1%_0.5W_100PPM_VISHAY_CRCW; Component Kind: Standard; Component Type: Standard; Pin Count: 2; Value: 49R9; Status: None; Tolerance: ±1%; Case: 1210; Mounted: Yes; Sense: No; Socket: No; SMD: Yes; ComponentHeight: 0.6mm; HelpURL: \\cern.ch\dfs\Applications\Altium\Datasheets\R1210_VISHAY_CRCW1210.pdf; Author: CERN DEM JMW; CreateDate: 06.08.2014; LatestRevisionDate: 06.08.2014
R39 R43 R48 R51 R56-R59 = R0402_10K_1%_0.0625W_100PPM: as R19 on sheet MCX_Buffer; Part Number: R0402_10K_1%_0.0625W_100PPM; Component Kind: Standard; Component Type: Standard; Pin Count: 2; Value: 10k; Status: Not recommended; Power: 0.0625W; Tolerance: ±1%; Manufacturer Part Number: R0402_10K_1%_0.0625W_100PPM; Case: 0402; Mounted: Yes; Sense: No; Socket: No; SMD: Yes; Manufacturer1 Example: YAGEO PHYCOMP; Manufacturer1 ComponentHeight: 0.4mm; HelpURL: \\cern.ch\dfs\Applications\Altium\Datasheets\R0402_Phycomp_RC0402.pdf; Author: CERN DEM JLC; CreateDate: 03.12.2007; LatestRevisionDate: 17.10.2012
R52-R55 = R0402_1K_1%_0.0625W_100PPM: as R3 on sheet MCX_Buffer; Part Number: R0402_1K_1%_0.0625W_100PPM; Component Kind: Standard; Component Type: Standard; Pin Count: 2; Value: 1k; Status: Not Recommended; Power: 0.0625W; Tolerance: ±1%; Manufacturer Part Number: R0402_1K_1%_0.0625W_100PPM; Case: 0402; Mounted: Yes; Sense: No; Socket: No; SMD: Yes; Manufacturer1 Example: YAGEO PHYCOMP; Manufacturer1 ComponentHeight: 0.4mm; HelpURL: \\cern.ch\dfs\Applications\Altium\Datasheets\R0402_Phycomp_RC0402.pdf; Author: CERN DEM JLC; CreateDate: 03.12.2007; LatestRevisionDate: 17.10.2012
SW3 = SW_OMRON_A6S-4102-H: as SW2 on sheet MCX_Buffer; Part Number: SW_OMRON_A6S-4102-H; Component Kind: Standard; Component Type: Standard; Pin Count: 8; PackageDescription: Pitch 2.54mm, Body 11.3x6.4mm, 4 Ways SPST Surface-Mounting DIP Switch, OMRON A6S-H; Family: Switch; Mounted: Yes; Socket: No; SMD: Yes; Sense: No; Status: None; Manufacturer Part Number: A6S-4102-H; ComponentHeight: 3.8mm; HelpURL: \\cern.ch\dfs\Applications\Altium\Datasheets\SW_OMRON_A6S-4102-H.pdf; Author: CERN DEM JMW; CreateDate: 25.09.2008; LatestRevisionDate: 25.09.2008
T6-T9 = BSS138LT1G: as T1 on sheet MCX_Buffer; Part Number: BSS138LT1G; Component Kind: Standard; Component Type: Standard; Device: BSS138LT1G; PackageDescription: SOT23 3-Leads, Pitch 0.95mm - Body 1.4x3mm, IPC Medium Density; Manufacturer Part Number: BSS138LT1G; Pin Count: 3; Case: SOT23-3; Mounted: Yes; Socket: No; SMD: Yes; Sense: No; ComponentHeight: 1.11mm; HelpURL: \\cern.ch\dfs\Applications\Altium\Datasheets\BSS138LT1G.pdf; Author: CERN DEM JLC; CreateDate: 23.03.2009; LatestRevisionDate: 23.03.2009

## Nets that join several sheets
GND: DIO_MCX (29 pins), DIO_MCX_Supply (14 pins), U_DIO_MCX/U_LVDS_IFCA (39 pins), U_DIO_MCX/U_LVDS_IFCB (39 pins), U_DIO_MCX/U_MCX_BufferA (35 pins), U_DIO_MCX/U_MCX_BufferB (35 pins), MCX_Mezzanine (19 pins), U_MCX_Mezzanine/U_MCX_BufferA (35 pins), U_MCX_Mezzanine/U_MCX_BufferB (35 pins)
P3V3: DIO_MCX (7 pins), DIO_MCX_Supply (6 pins), U_DIO_MCX/U_LVDS_IFCA (26 pins), U_DIO_MCX/U_LVDS_IFCB (26 pins), U_DIO_MCX/U_MCX_BufferA (15 pins), U_DIO_MCX/U_MCX_BufferB (15 pins), MCX_Mezzanine (J7.1 J7.25), U_MCX_Mezzanine/U_MCX_BufferA (15 pins), U_MCX_Mezzanine/U_MCX_BufferB (15 pins)
P3V3_MP: DIO_MCX (5 pins), DIO_MCX_Supply (B3.1 R10.1), U_DIO_MCX/U_LVDS_IFCA (C10A.2 IC8A.4 J2A.30), U_DIO_MCX/U_LVDS_IFCB (C10B.2 IC8B.4 J2B.30)
P12V0: DIO_MCX_Supply (6 pins), U_DIO_MCX/U_LVDS_IFCA (J2A.28 J2A.29), U_DIO_MCX/U_LVDS_IFCB (J2B.28 J2B.29)
I2C_SCL: U_DIO_MCX/U_LVDS_IFCA (IC8A.1 J2A.27), U_DIO_MCX/U_LVDS_IFCB (IC8B.1 J2B.27)
I2C_SDA: U_DIO_MCX/U_LVDS_IFCA (IC8A.3 J2A.26), U_DIO_MCX/U_LVDS_IFCB (IC8B.3 J2B.26)
LVDS0_N: U_DIO_MCX/U_LVDS_IFCA (IC1A.14 J2A.3 R13A.2), U_DIO_MCX/U_LVDS_IFCB (IC1B.14 J2B.3 R13B.2)
LVDS0_P: U_DIO_MCX/U_LVDS_IFCA (IC1A.13 J2A.2 R13A.1), U_DIO_MCX/U_LVDS_IFCB (IC1B.13 J2B.2 R13B.1)
LVDS1_N: U_DIO_MCX/U_LVDS_IFCA (IC1A.10 J2A.6 R11A.2), U_DIO_MCX/U_LVDS_IFCB (IC1B.10 J2B.6 R11B.2)
LVDS1_P: U_DIO_MCX/U_LVDS_IFCA (IC1A.9 J2A.5 R11A.1), U_DIO_MCX/U_LVDS_IFCB (IC1B.9 J2B.5 R11B.1)
LVDS7_N: U_DIO_MCX/U_LVDS_IFCA (IC6A.48 J2A.24 R16A.2), U_DIO_MCX/U_LVDS_IFCB (IC6B.48 J2B.24 R16B.2)
LVDS7_P: U_DIO_MCX/U_LVDS_IFCA (IC6A.47 J2A.23 R16A.1), U_DIO_MCX/U_LVDS_IFCB (IC6B.47 J2B.23 R16B.1)
NetIC1A_1: U_DIO_MCX/U_LVDS_IFCA (IC1A.1 IC1A.40), U_DIO_MCX/U_LVDS_IFCB (IC1B.1 IC1B.40)
NetIC1A_5: U_DIO_MCX/U_LVDS_IFCA (IC1A.5 IC1A.42), U_DIO_MCX/U_LVDS_IFCB (IC1B.5 IC1B.42)
NetIC1A_8: U_DIO_MCX/U_LVDS_IFCA (IC1A.8 IC1A.19), U_DIO_MCX/U_LVDS_IFCB (IC1B.8 IC1B.19)
NetIC1A_12: U_DIO_MCX/U_LVDS_IFCA (IC1A.12 IC1A.21), U_DIO_MCX/U_LVDS_IFCB (IC1B.12 IC1B.21)
NetIC1A_20: U_DIO_MCX/U_LVDS_IFCA (8 pins), U_DIO_MCX/U_LVDS_IFCB (8 pins)
NetIC1A_25: U_DIO_MCX/U_LVDS_IFCA (IC1A.25 IC1A.26), U_DIO_MCX/U_LVDS_IFCB (IC1B.25 IC1B.26)
NetIC1A_28: U_DIO_MCX/U_LVDS_IFCA (IC1A.28 IC1A.29), U_DIO_MCX/U_LVDS_IFCB (IC1B.28 IC1B.29)
NetIC1A_32: U_DIO_MCX/U_LVDS_IFCA (IC1A.32 IC1A.33), U_DIO_MCX/U_LVDS_IFCB (IC1B.32 IC1B.33)
NetIC1A_35: U_DIO_MCX/U_LVDS_IFCA (IC1A.35 IC1A.36), U_DIO_MCX/U_LVDS_IFCB (IC1B.35 IC1B.36)
NetIC2A_1: U_DIO_MCX/U_MCX_BufferA (IC2A.1), U_DIO_MCX/U_MCX_BufferB (IC2B.1), U_MCX_Mezzanine/U_MCX_BufferA (IC3A.1), U_MCX_Mezzanine/U_MCX_BufferB (IC3B.1)
NetIC2A_24: U_DIO_MCX/U_MCX_BufferA (IC2A.24), U_DIO_MCX/U_MCX_BufferB (IC2B.24), U_MCX_Mezzanine/U_MCX_BufferA (IC3A.24), U_MCX_Mezzanine/U_MCX_BufferB (IC3B.24)
NetIC2A_25: U_DIO_MCX/U_MCX_BufferA (IC2A.25 IC2A.48), U_DIO_MCX/U_MCX_BufferB (IC2B.25 IC2B.48), U_MCX_Mezzanine/U_MCX_BufferA (IC3A.25 IC3A.48), U_MCX_Mezzanine/U_MCX_BufferB (IC3B.25 IC3B.48)
NetIC6A_1: U_DIO_MCX/U_LVDS_IFCA (IC6A.1 IC6A.40), U_DIO_MCX/U_LVDS_IFCB (IC6B.1 IC6B.40)
NetIC6A_5: U_DIO_MCX/U_LVDS_IFCA (IC6A.5 IC6A.42), U_DIO_MCX/U_LVDS_IFCB (IC6B.5 IC6B.42)
NetIC6A_8: U_DIO_MCX/U_LVDS_IFCA (IC6A.8 IC6A.19), U_DIO_MCX/U_LVDS_IFCB (IC6B.8 IC6B.19)
NetIC6A_12: U_DIO_MCX/U_LVDS_IFCA (IC6A.12 IC6A.21), U_DIO_MCX/U_LVDS_IFCB (IC6B.12 IC6B.21)
NetIC6A_25: U_DIO_MCX/U_LVDS_IFCA (IC6A.25 IC6A.26), U_DIO_MCX/U_LVDS_IFCB (IC6B.25 IC6B.26)
NetIC6A_28: U_DIO_MCX/U_LVDS_IFCA (IC6A.28 IC6A.29), U_DIO_MCX/U_LVDS_IFCB (IC6B.28 IC6B.29)
NetIC6A_32: U_DIO_MCX/U_LVDS_IFCA (IC6A.32 IC6A.33), U_DIO_MCX/U_LVDS_IFCB (IC6B.32 IC6B.33)
NetIC6A_35: U_DIO_MCX/U_LVDS_IFCA (IC6A.35 IC6A.36), U_DIO_MCX/U_LVDS_IFCB (IC6B.35 IC6B.36)
NetR26A_2: U_DIO_MCX/U_MCX_BufferA (R26A.2), U_DIO_MCX/U_MCX_BufferB (R26B.2), U_MCX_Mezzanine/U_MCX_BufferA (R37A.2), U_MCX_Mezzanine/U_MCX_BufferB (R37B.2)
NetR27A_2: U_DIO_MCX/U_MCX_BufferA (R27A.2), U_DIO_MCX/U_MCX_BufferB (R27B.2), U_MCX_Mezzanine/U_MCX_BufferA (R40A.2), U_MCX_Mezzanine/U_MCX_BufferB (R40B.2)
NetR28A_2: U_DIO_MCX/U_MCX_BufferA (R28A.2), U_DIO_MCX/U_MCX_BufferB (R28B.2), U_MCX_Mezzanine/U_MCX_BufferA (R44A.2), U_MCX_Mezzanine/U_MCX_BufferB (R44B.2)
NetR29A_2: U_DIO_MCX/U_MCX_BufferA (R29A.2), U_DIO_MCX/U_MCX_BufferB (R29B.2), U_MCX_Mezzanine/U_MCX_BufferA (R46A.2), U_MCX_Mezzanine/U_MCX_BufferB (R46B.2)

## Assembly variants
Murata_DCDC: not fitted IC12 IC12 IC31 IC31